# EAGLE design rapidshark-main-breakout-mk-1.0 (EAGLE 6.5.0)
AUTHOR: sean@yak.net
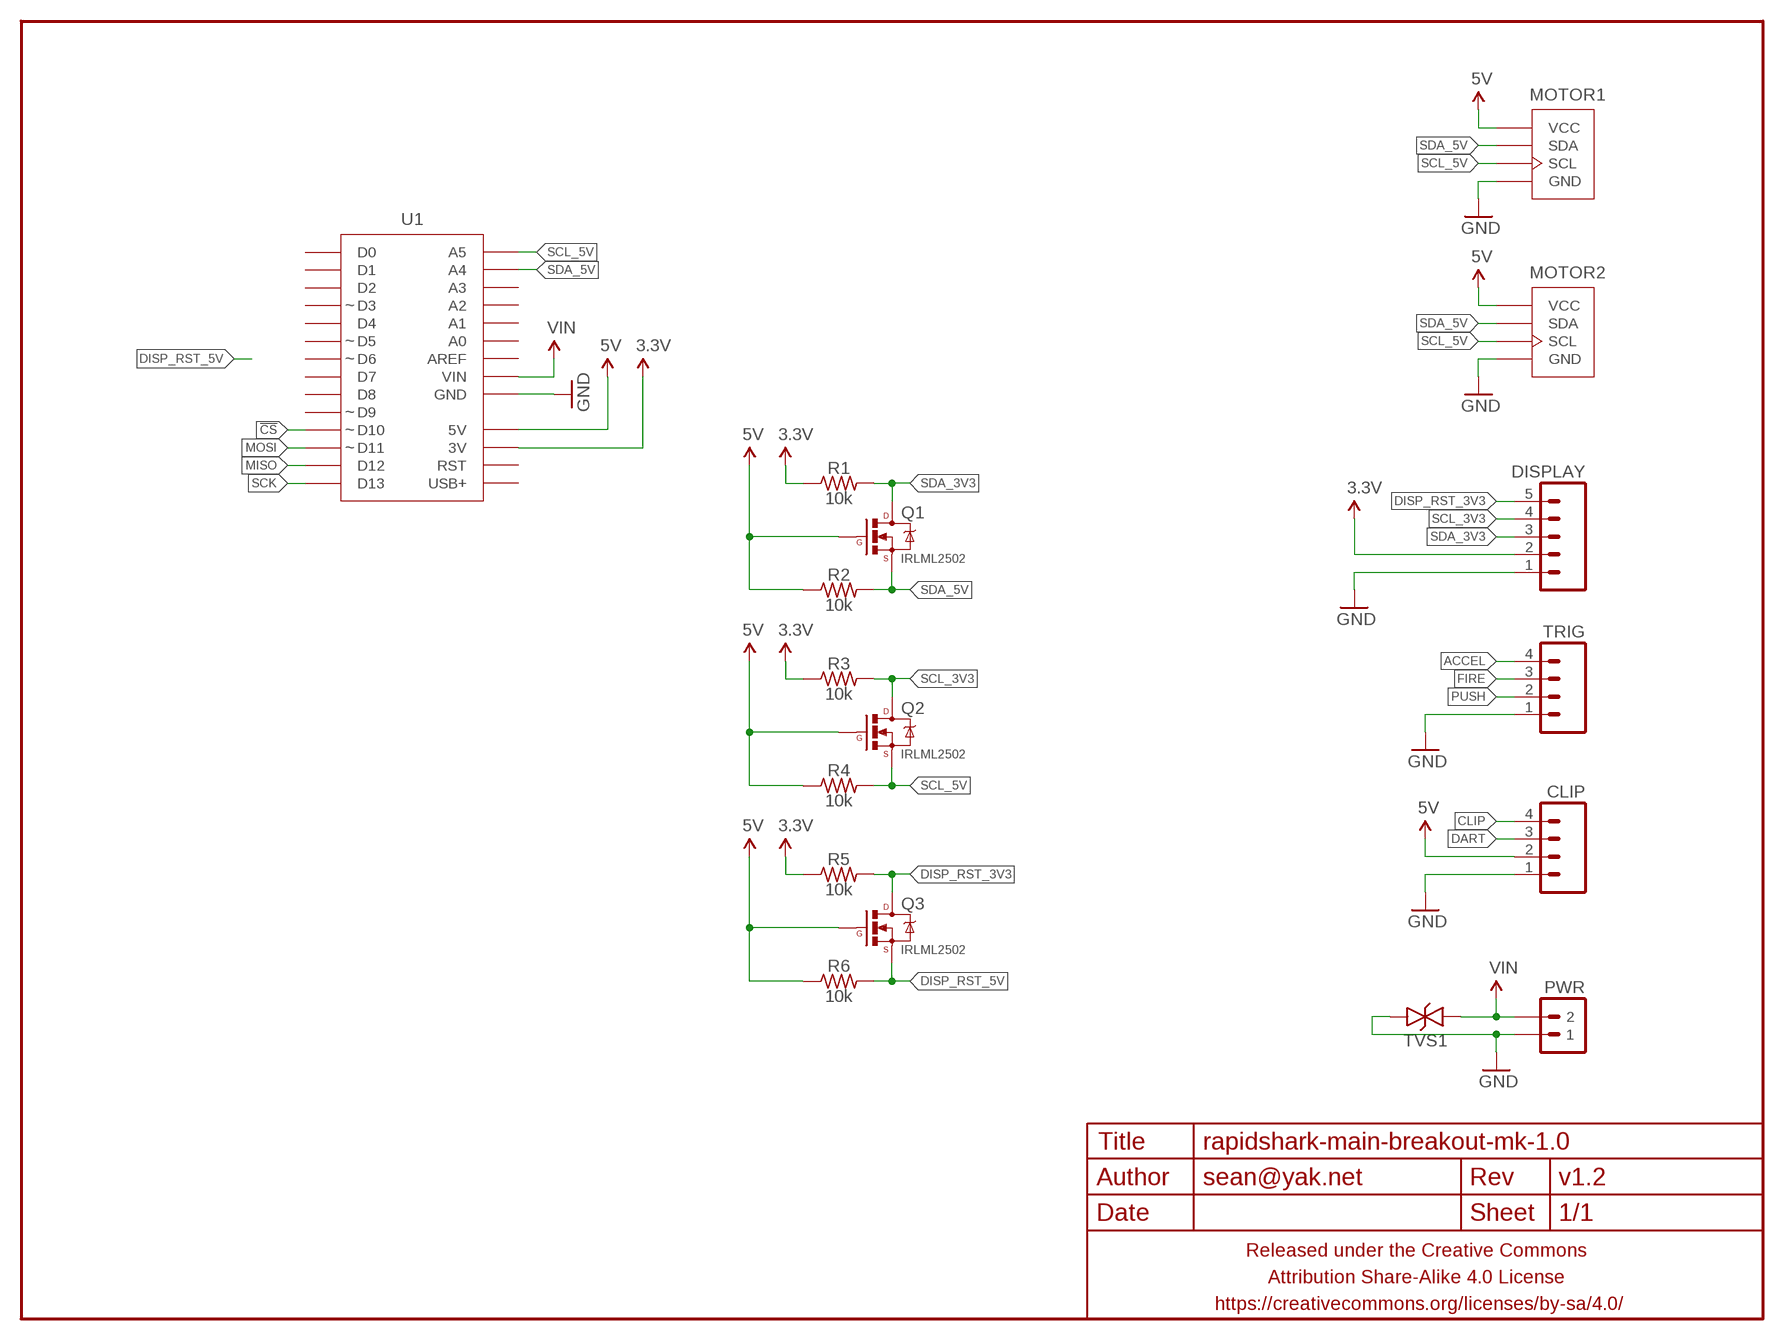
[diagram p0: schematic, sheet 1]

## Parts
CLIP  M04JST-PTH-VERT  [JST-4-PH-VERT-PTH]
DISPLAY  M05JST-PH-VERT-PTH  [JST-5-PH-VERT-PTH]
FRAME1  FRAME-LETTERNO_PACKAGE  [DUMMY]
MOTOR1  M04-I2CJST-4-PH-VERT-NS  [JST-4-PH-VERT-PTH]
MOTOR2  M04-I2CJST-4-PH-VERT-NS  [JST-4-PH-VERT-PTH]
PWR  M02PTH-CENTERED-R+  [1X02-CENTER-R+]
Q1  IRLML2502  MOSFET-NCHANNELIRLML2502  [SOT23]
Q2  IRLML2502  MOSFET-NCHANNELIRLML2502  [SOT23]
Q3  IRLML2502  MOSFET-NCHANNELIRLML2502  [SOT23]
R1  10k  RESISTORR0603  [R0603]
R2  10k  RESISTORR0603  [R0603]
R3  10k  RESISTORR0603  [R0603]
R4  10k  RESISTORR0603  [R0603]
R5  10k  RESISTORR0603  [R0603]
R6  10k  RESISTORR0603  [R0603]
TRIG  M04JST-PTH-VERT  [JST-4-PH-VERT-PTH]
TVS1  TVSSMA  [SMA-DIODE-TVS-BIDIR]
U1  ADAFRUIT_METRO_MINISMD-NOHOLES  [ADAFRUIT_METRO_MINI_SMD]

## Nets
3.3V: DISPLAY.2 R1.1 R3.1 R5.1 U1.17(3V)
5V: CLIP.2 MOTOR1.2(VCC) MOTOR2.2(VCC) Q1.1(G) Q2.1(G) Q3.1(G) R2.1 R4.1 R6.1 U1.18(5V)
!CS: U1.11(D10)
ACCEL: TRIG.4
CLIP: CLIP.4
DART: CLIP.3
DISP_RST_3V3: DISPLAY.5 Q3.3(D) R5.2
DISP_RST_5V: Q3.2(S) R6.2
FIRE: TRIG.3
GND: CLIP.1 DISPLAY.1 MOTOR1.1(GND) MOTOR2.1(GND) PWR.1 TRIG.1 TVS1.2 U1.19(GND) U1.20(GND)
MISO: U1.13(D12)
MOSI: U1.12(D11)
PUSH: TRIG.2
SCK: U1.14(D13)
SCL_3V3: DISPLAY.4 Q2.3(D) R3.2
SCL_5V: MOTOR1.4(SCL) MOTOR2.4(SCL) Q2.2(S) R4.2 U1.28(A5)
SDA_3V3: DISPLAY.3 Q1.3(D) R1.2
SDA_5V: MOTOR1.3(SDA) MOTOR2.3(SDA) Q1.2(S) R2.2 U1.27(A4)
VIN: PWR.2 TVS1.1 U1.21(VIN)
Unconnected: U1.1(D0) U1.2(D1) U1.3(D2) U1.4(D3) U1.5(D4) U1.6(D5) U1.7(D6) U1.8(D7) U1.9(D8) U1.10(D9) U1.15(USB+) U1.16(RST) U1.22(AREF) U1.23(A0) U1.24(A1) U1.25(A2) U1.26(A3)

## Library data of the parts
CLIP TRIG = A_butts:M04: Header 4 Standard 4-pin 0.1" header. Use with straight break away headers (SKU : PRT-00116), right angle break away headers (PRT-00553), swiss pins (PRT-00743), machine pins (PRT-00117), and female headers (PRT-00115). Molex polarized connector foot print use with SKU : PRT-08231 with associated crimp pins and housings. 1MM SMD Version SKU: PRT-10208
DISPLAY = A_butts:M05: Header 5 Standard 5-pin 0.1" header. Use with straight break away headers (SKU : PRT-00116), right angle break away headers (PRT-00553), swiss pins (PRT-00743), machine pins (PRT-00117), and female headers (PRT-00115). Molex polarized connector foot print use with SKU : PRT-08230 with associated crimp pins and housings.
FRAME1 = A_butts:FRAME-LETTER: Schematic Frame Standard 8.5x11 US Letter frame; DESIGNER: sean@yak.net; VERSION: v1.2
MOTOR1 MOTOR2 = A_butts:M04-I2C
PWR = A_butts:M02: Standard 2-pin 0.1" header. Use with - straight break away headers ( PRT-00116) - right angle break away headers (PRT-00553) - swiss pins (PRT-00743) - machine pins (PRT-00117) - female headers (PRT-00115) Molex polarized connector foot print use with: PRT-08233 with associated crimp pins and housings. 2.54_SCREWTERM for use with PRT-10571. 3.5mm Screw Terminal footprints for PRT-08084 5mm Screw Terminal footprints for use with PRT-08433
Q1-Q3 = A_butts:MOSFET-NCHANNEL: Common NMOSFET Parts MFG P/N Store ID Prod ID FDD8780 TRANS-09984 SI7820DN TRANS-11055 FDS6630A IC-08089 2N7002PW TRANS-11151 FQP30N06L COM-10213 TRANS-10060 BSS123LT1G TRANS-08345 BSS138 TRANS-00830 BS170 2N7000
R1-R6 = A_butts:RESISTOR: RESISTOR, American symbol
TVS1 = A_butts:TVS: Transient voltage suppressor- prevents ESD on inputs. Ignore package description- MBRA140 is NOT this type of part!!!
U1 = A_butts:ADAFRUIT_METRO_MINI

## Board
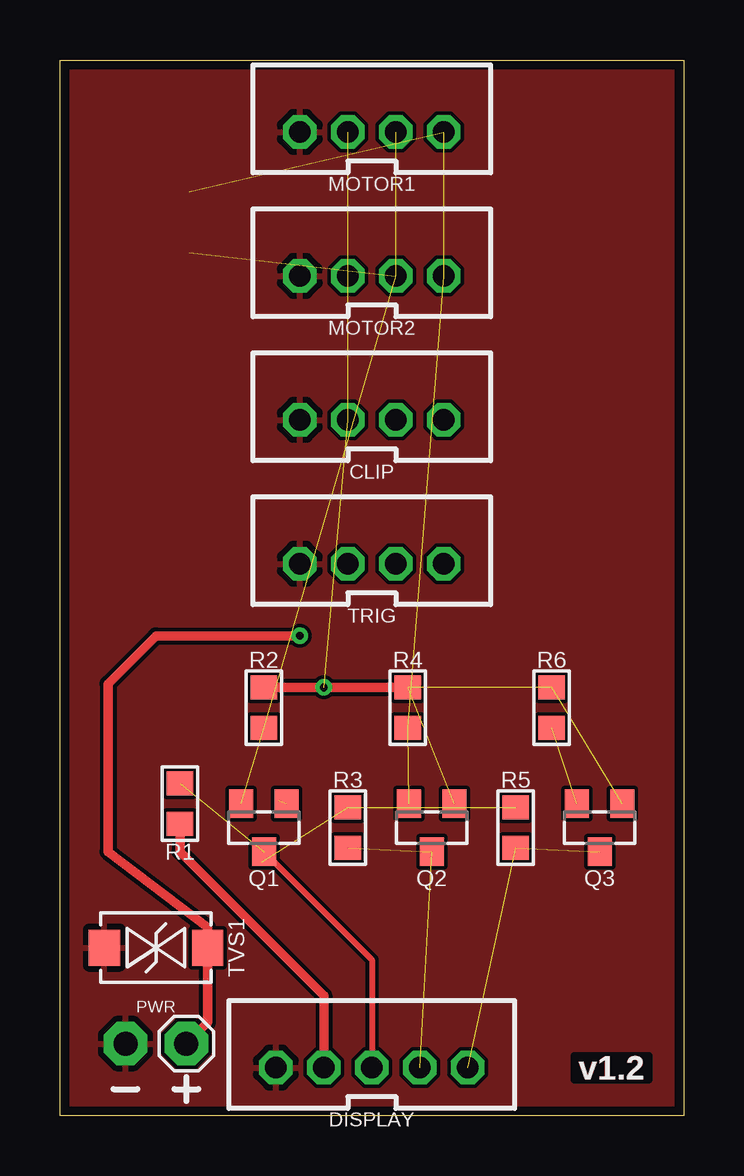
[diagram p1: board, top side]
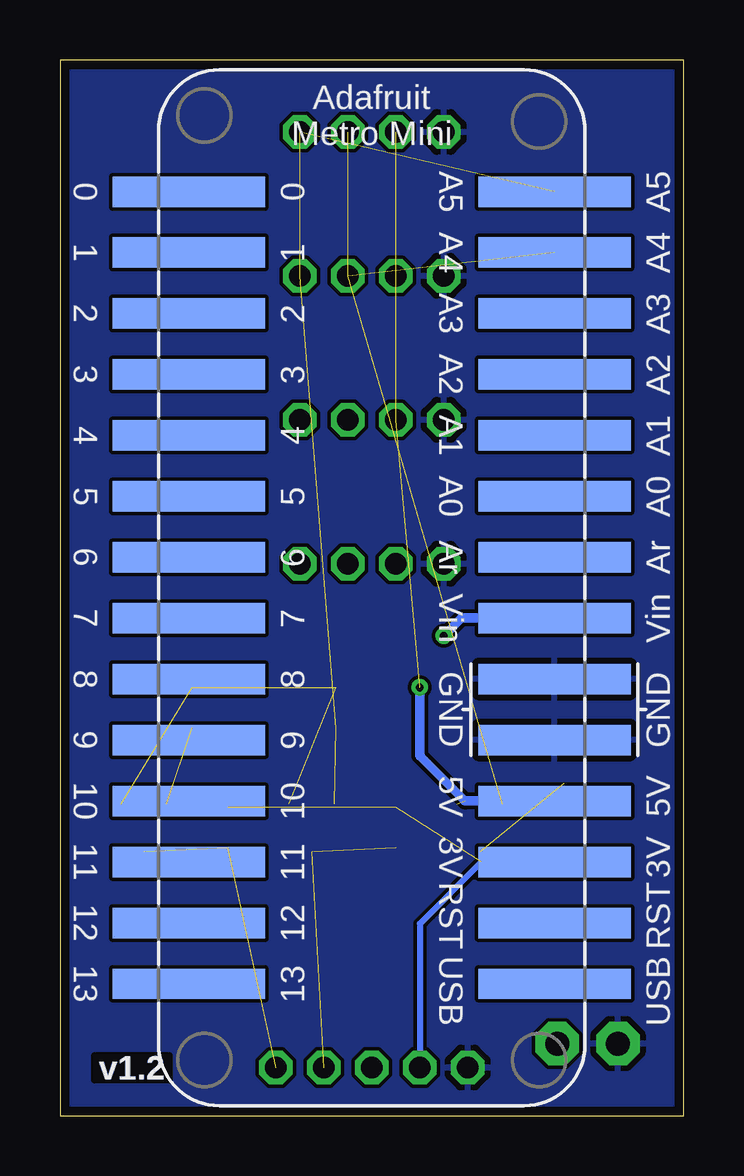
[diagram p2: board, bottom side, seen from below]

Size 26 x 44 mm. Coordinates in mm from the lower left corner, seen from the top.
Outline: 26,0 0,0 0,44 26,44 26,0
Copper layers (1*16): Top 0.0356mm / dielectric 1.5011mm / Bottom 0.0356mm
Design rules "LaenPCBOrder_2": minimum track width 6mil, minimum drill 13mil, track to track 6mil, track to pad 6mil, pad to pad 6mil, via to via 6mil, smd to smd 6mil, copper to edge 15mil, drill to drill 6mil, minimum pad ring 7mil, minimum via ring 7mil, stop-mask expansion 3mil, vias tented up to drill 20mil, thermal gap 10mil

### Footprints (pad centres in the part's own frame; a part is rotated, then mirrored left to right if it is on the bottom)
JST-4-PH-VERT-PTH = drill 0.9 pad 1.4 octagon: 1 0,0; 2 2,0; 3 4,0; 4 6,0
JST-5-PH-VERT-PTH = drill 0.9 pad 1.4 octagon: 1 -4,0; 2 -2,0; 3 0,0; 4 2,0; 5 4,0
1X02-CENTER-R+ = drill 1 pad 1.8 octagon: 1 -1.27,0; 2 1.27,0
SOT23 = smd 1 x 1.2: 1 -0.95,-1; 2 0.95,-1; 3 0,1
R0603 = smd 1 x 1.1: 1 -0.85,0; 2 0.85,0
SMA-DIODE-TVS-BIDIR = smd 1.3 x 1.5: 1 -2.15,0; 2 2.15,0
ADAFRUIT_METRO_MINI_SMD = smd 1.27 x 6.35: 1 16.51,7.62; 2 13.97,7.62; 3 11.43,7.62; 4 8.89,7.62; 5 6.35,7.62; 6 3.81,7.62; 7 1.27,7.62; 8 -1.27,7.62; 9 -3.81,7.62; 10 -6.35,7.62; 11 -8.89,7.62; 12 -11.43,7.62; 13 -13.97,7.62; 14 -16.51,7.62; 15 -16.51,-7.62; 16 -13.97,-7.62; 17 -11.43,-7.62; 18 -8.89,-7.62; 19 -6.35,-7.62; 20 -3.81,-7.62; 21 -1.27,-7.62; 22 1.27,-7.62; 23 3.81,-7.62; 24 6.35,-7.62; 25 8.89,-7.62; 26 11.43,-7.62; 27 13.97,-7.62; 28 16.51,-7.62

### Placement (x,y rotation side)
CLIP  10,29 0 top
DISPLAY  13,2 0 top
FRAME1  0,0 0 bottom
MOTOR1  10,41 0 top
MOTOR2  10,35 0 top
PWR  4,3 0 top
Q1  8.5,12 180 top
Q2  15.5,12 180 top
Q3  22.5,12 180 top
R1  5,13 90 top
R2  8.5,17 270 top
R3  12,12 270 top
R4  14.5,17 270 top
R5  19,12 270 top
R6  20.5,17 270 top
TRIG  10,23 0 top
TVS1  4,7 180 top
U1  13,22 90 bottom

### Tracks (layer width: path | path; a pad name or v marks a point on that pad's centre or on a via)
3.3V  (2 unrouted)
  Top 0.4: R1.1 5,11 11,5 DISPLAY.2
  Bottom 0.25: U1.17 8.43,10.57 11,8 DISPLAY.2
5V  (via drill 0.33)  (7 unrouted)
  Top 0.4: R4.1 v11,17.85 R2.1
  Bottom 0.4: U1.18 9.11,13.11 11,15 v11,17.85
DISP_RST_3V3  (2 unrouted)
DISP_RST_5V  (1 unrouted)
GND
  pour Top (rank 6): 0,0 0,44 26,44 26,0
  pour Bottom (rank 6): 0,0 0,44 26,44 26,0
SCL_3V3  (2 unrouted)
SCL_5V  (4 unrouted)
SDA_3V3  (1 unrouted)
  Top 0.25: Q1.3 13,6.5 DISPLAY.3
SDA_5V  (4 unrouted)
VIN  (via drill 0.33)
  Top 0.4: PWR.2 6.15,3.88 TVS1.1 6.15,7.85 2,11 2,18 4,20 v10,20
  Bottom 0.4: U1.21 9.27,20.73 v10,20